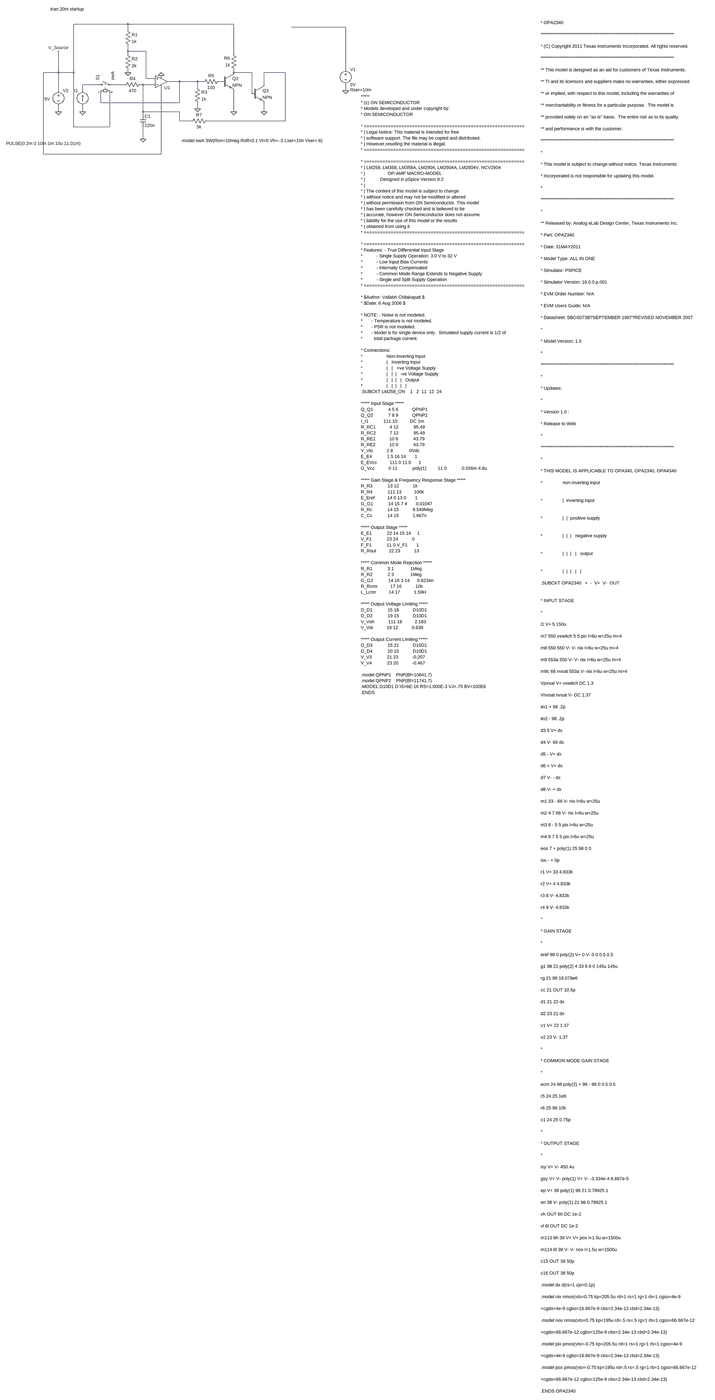
[diagram p0: schematic analog_OVC_switchoff.asc, whole sheet]
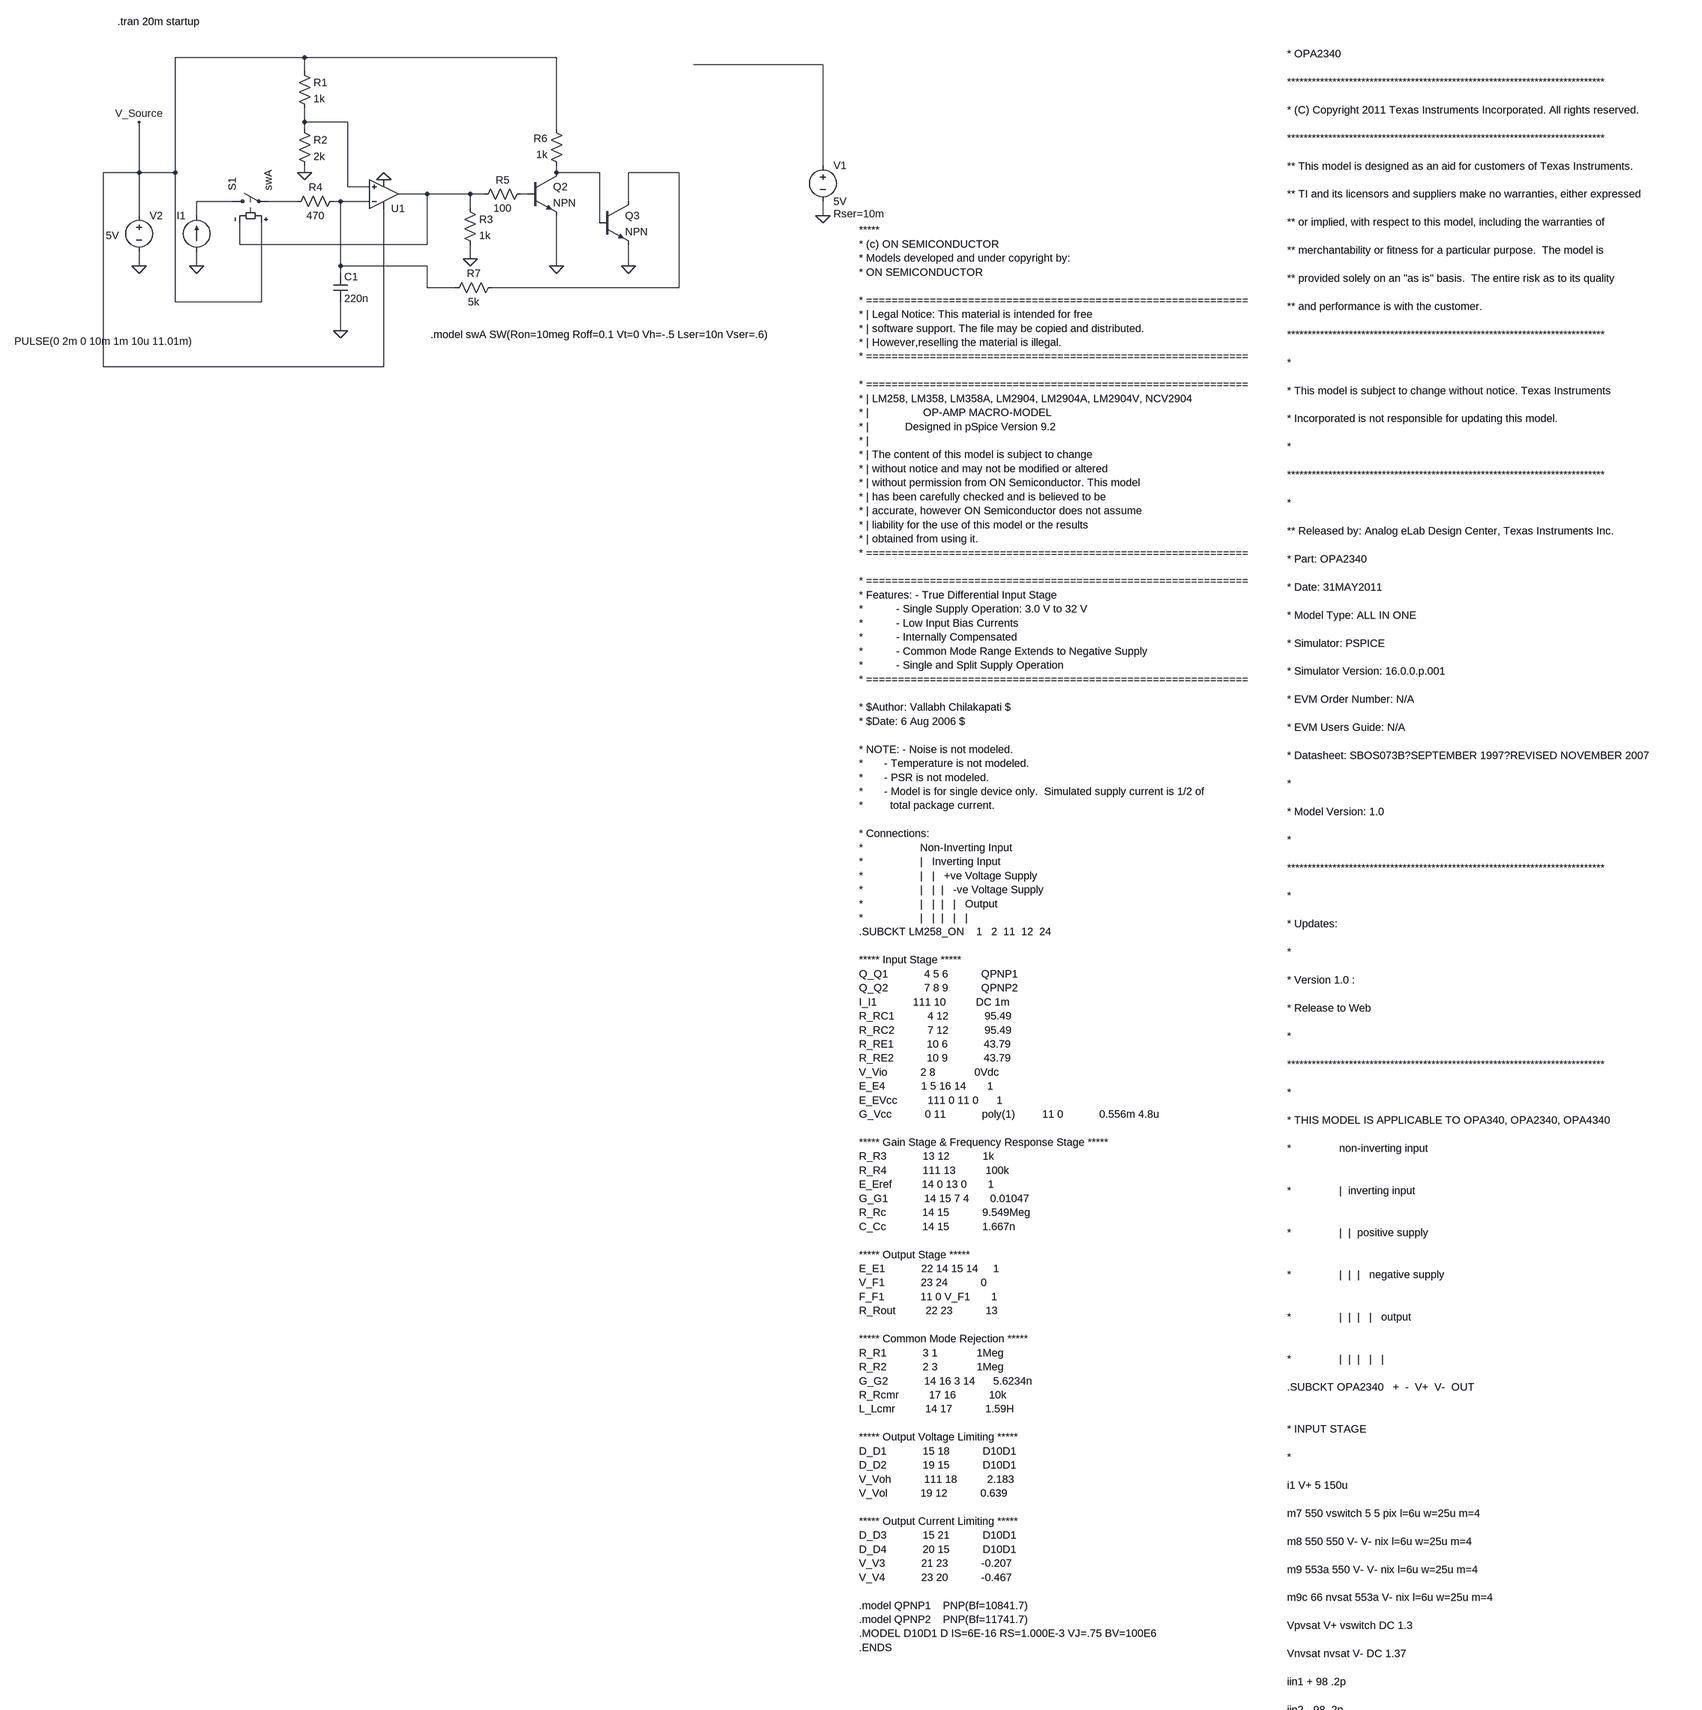
[diagram p1: schematic analog_OVC_switchoff.asc, part, row 1 of 2, column 1 of 1]
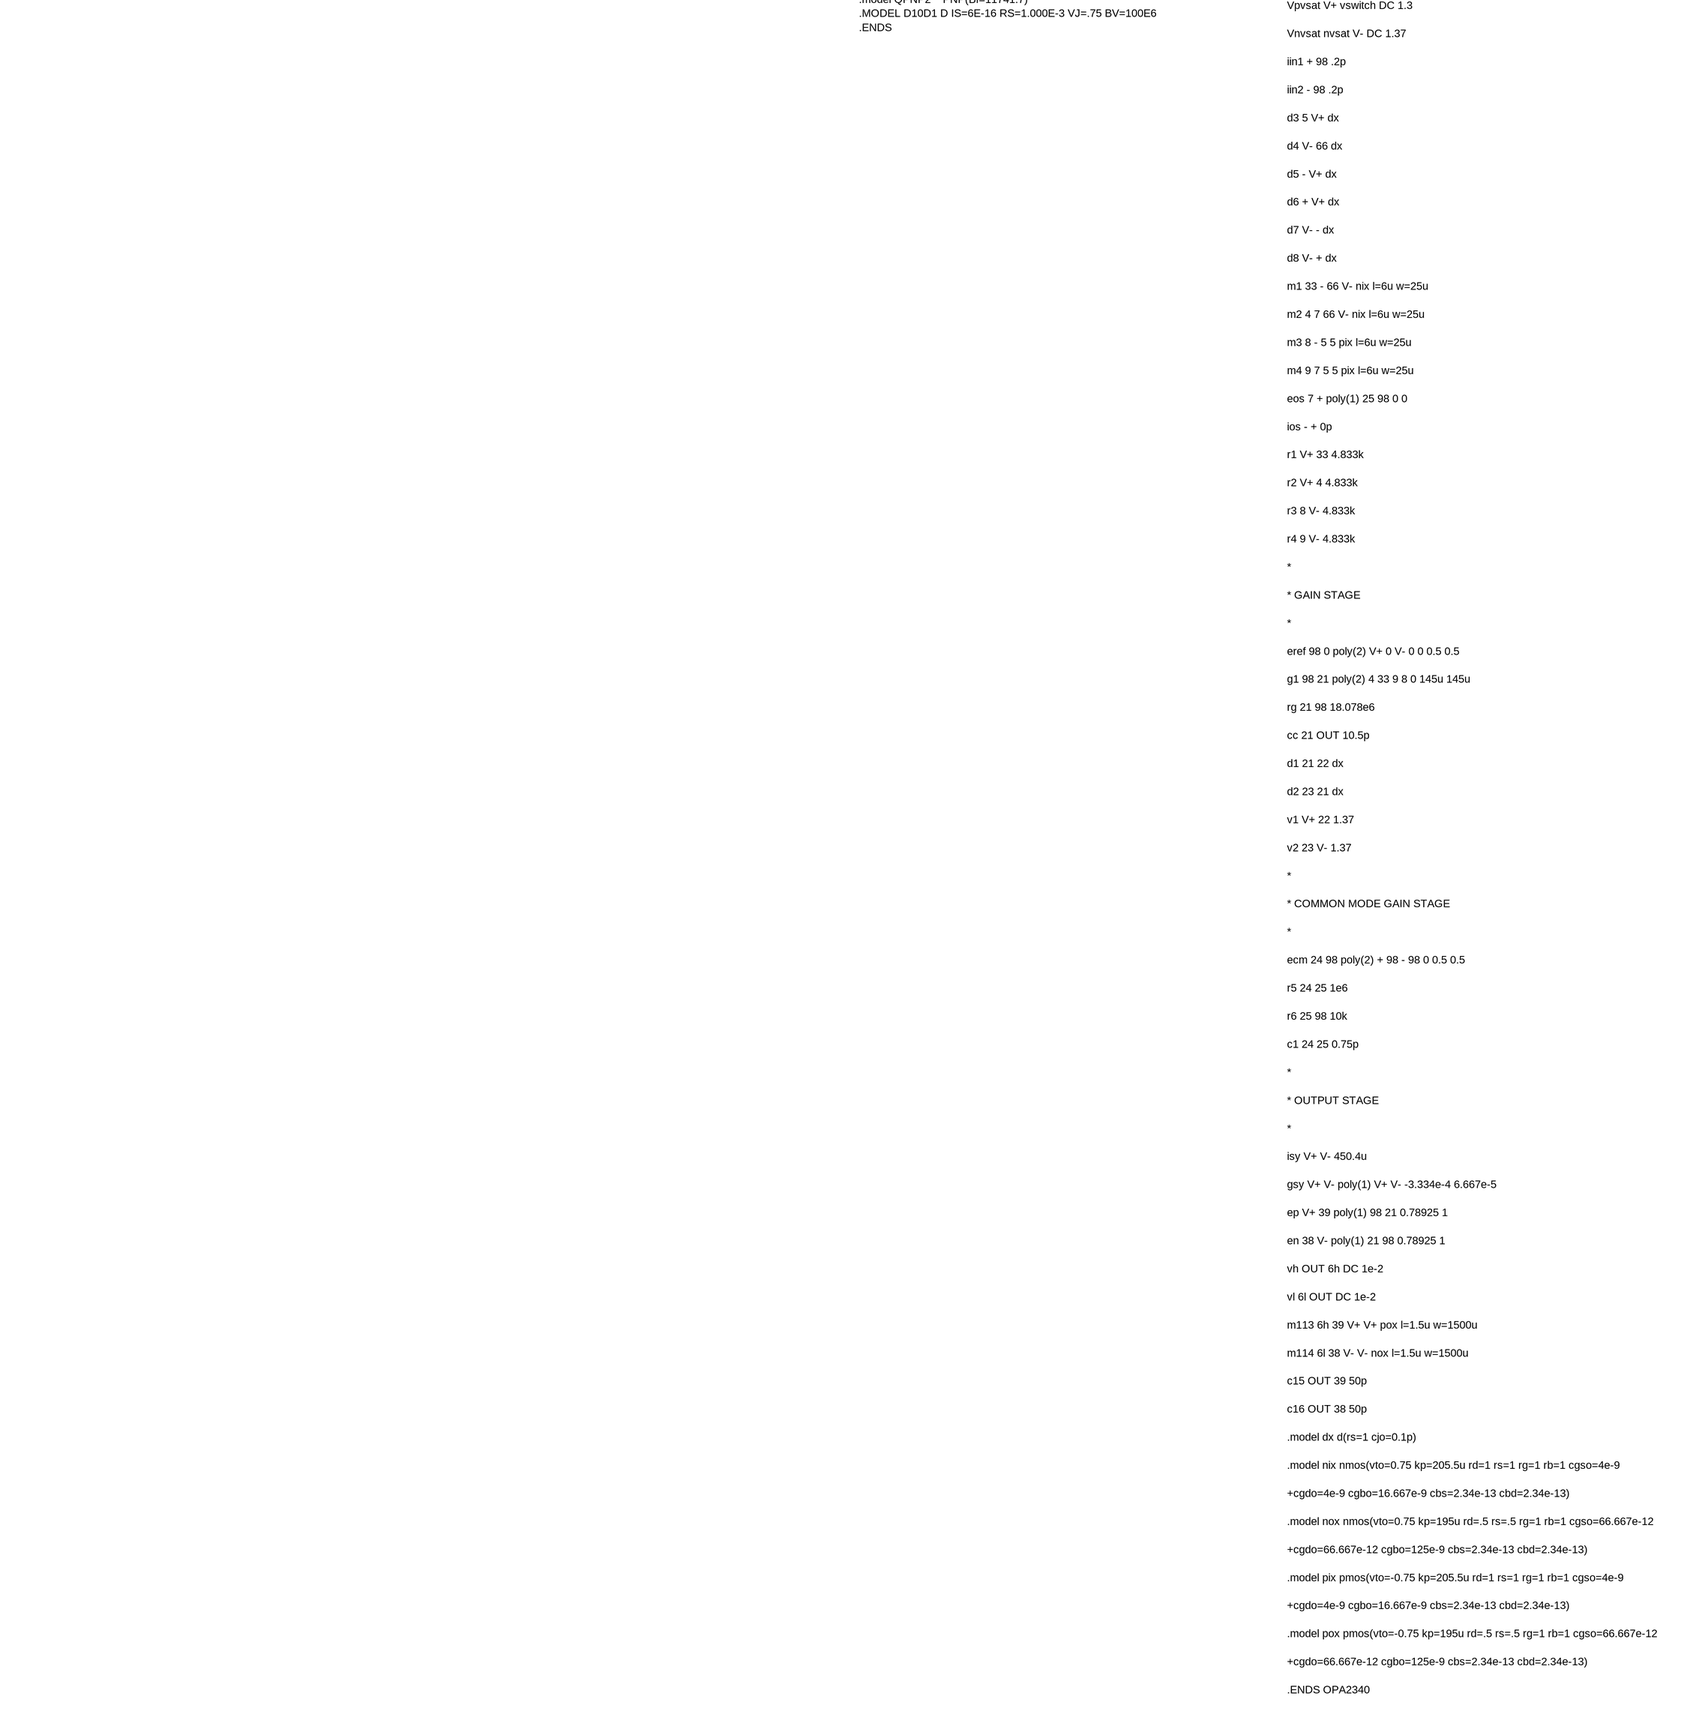
[diagram p2: schematic analog_OVC_switchoff.asc, part, row 2 of 2, column 1 of 1]
analog_OVC_switchoff.asc, the LTspice schematic file:
Version 4
SHEET 1 880 680
WIRE -6816 -5744 -7104 -5744
WIRE -6256 -5744 -6816 -5744
WIRE -5664 -5728 -5952 -5728
WIRE -6816 -5712 -6816 -5744
WIRE -6816 -5600 -6816 -5632
WIRE -6720 -5600 -6816 -5600
WIRE -6816 -5584 -6816 -5600
WIRE -6256 -5584 -6256 -5744
WIRE -5664 -5504 -5664 -5728
WIRE -7184 -5488 -7184 -5600
WIRE -7184 -5488 -7264 -5488
WIRE -7104 -5488 -7104 -5744
WIRE -7104 -5488 -7184 -5488
WIRE -6816 -5488 -6816 -5504
WIRE -6256 -5488 -6256 -5504
WIRE -6160 -5488 -6256 -5488
WIRE -5984 -5488 -6096 -5488
WIRE -6720 -5456 -6720 -5600
WIRE -6672 -5456 -6720 -5456
WIRE -6544 -5440 -6608 -5440
WIRE -6448 -5440 -6544 -5440
WIRE -6416 -5440 -6448 -5440
WIRE -6320 -5440 -6336 -5440
WIRE -6976 -5424 -7056 -5424
WIRE -6832 -5424 -6896 -5424
WIRE -6736 -5424 -6752 -5424
WIRE -6672 -5424 -6736 -5424
WIRE -6096 -5424 -6096 -5488
WIRE -6448 -5408 -6448 -5440
WIRE -7184 -5392 -7184 -5488
WIRE -7056 -5392 -7056 -5424
WIRE -5664 -5392 -5664 -5424
WIRE -6160 -5376 -6160 -5488
WIRE -6960 -5328 -6960 -5376
WIRE -6544 -5328 -6544 -5440
WIRE -6544 -5328 -6960 -5328
WIRE -6448 -5296 -6448 -5328
WIRE -7184 -5280 -7184 -5312
WIRE -7056 -5280 -7056 -5312
WIRE -6736 -5280 -6736 -5424
WIRE -6544 -5280 -6736 -5280
WIRE -6256 -5280 -6256 -5392
WIRE -6096 -5280 -6096 -5328
WIRE -6736 -5264 -6736 -5280
WIRE -6544 -5232 -6544 -5280
WIRE -6480 -5232 -6544 -5232
WIRE -5984 -5232 -5984 -5488
WIRE -5984 -5232 -6400 -5232
WIRE -7104 -5200 -7104 -5488
WIRE -6912 -5200 -6912 -5376
WIRE -6912 -5200 -7104 -5200
WIRE -6736 -5136 -6736 -5200
WIRE -7264 -5056 -7264 -5488
WIRE -6640 -5056 -6640 -5408
WIRE -6640 -5056 -7264 -5056
FLAG -7056 -5280 0
FLAG -5664 -5392 0
FLAG -6736 -5136 0
FLAG -7184 -5280 0
FLAG -7184 -5600 V_Source
FLAG -6640 -5472 0
FLAG -6816 -5488 0
FLAG -6448 -5296 0
FLAG -6096 -5280 0
FLAG -6256 -5280 0
SYMBOL voltage -5664 -5520 R0
WINDOW 123 0 0 Left 0
WINDOW 39 24 124 Left 0
SYMATTR SpiceLine Rser=10m
SYMATTR InstName V1
SYMATTR Value 5V
SYMBOL res -6848 -5408 R270
WINDOW 0 32 56 VTop 0
WINDOW 3 0 56 VBottom 0
SYMATTR InstName R4
SYMATTR Value 470
SYMBOL voltage -7184 -5408 R0
WINDOW 123 0 0 Left 0
WINDOW 39 0 0 Left 0
WINDOW 3 -74 60 Left 0
SYMATTR Value 5V
SYMATTR InstName V2
SYMBOL current -7056 -5312 R180
WINDOW 0 24 80 Left 0
WINDOW 3 7 -199 Left 0
WINDOW 123 0 0 Left 0
WINDOW 39 0 0 Left 0
SYMATTR InstName I1
SYMATTR Value PULSE(0 2m 0 10m 1m 10u 11.01m)
SYMBOL Opamps\\opamp2 -6640 -5376 M180
SYMATTR InstName U1
SYMATTR Value ""
SYMATTR SpiceModel OPA2340
SYMBOL res -6832 -5728 R0
SYMATTR InstName R1
SYMATTR Value 1k
SYMBOL res -6832 -5600 R0
SYMATTR InstName R2
SYMATTR Value 2k
SYMBOL res -6464 -5424 R0
SYMATTR InstName R3
SYMATTR Value 1k
SYMBOL cap -6752 -5264 R0
SYMATTR InstName C1
SYMATTR Value 220n
SYMBOL npn -6320 -5488 R0
SYMATTR InstName Q2
SYMBOL npn -6160 -5424 R0
SYMATTR InstName Q3
SYMBOL res -6320 -5456 R90
WINDOW 0 0 56 VBottom 0
WINDOW 3 32 56 VTop 0
SYMATTR InstName R5
SYMATTR Value 100
SYMBOL res -6240 -5488 R180
WINDOW 0 36 76 Left 0
WINDOW 3 36 40 Left 0
SYMATTR InstName R6
SYMATTR Value 1k
SYMBOL res -6384 -5248 R90
WINDOW 0 0 56 VBottom 0
WINDOW 3 32 56 VTop 0
SYMATTR InstName R7
SYMATTR Value 5k
SYMBOL sw -6992 -5424 R270
SYMATTR InstName S1
SYMATTR Value swA
TEXT -7232 -5824 Left 0 !.tran 20m startup
TEXT -5584 -5360 Left 0 !*****\n* (c) ON SEMICONDUCTOR\n* Models developed and under copyright by:\n* ON SEMICONDUCTOR \n \n* ============================================================\n* | Legal Notice: This material is intended for free  \n* | software support. The file may be copied and distributed. \n* | However,reselling the material is illegal.\n* ============================================================\n \n* ============================================================      \n* | LM258, LM358, LM358A, LM2904, LM2904A, LM2904V, NCV2904\n* |                  OP-AMP MACRO-MODEL\n* |            Designed in pSpice Version 9.2\n* |\n* | The content of this model is subject to change\n* | without notice and may not be modified or altered\n* | without permission from ON Semiconductor. This model\n* | has been carefully checked and is believed to be\n* | accurate, however ON Semiconductor does not assume \n* | liability for the use of this model or the results \n* | obtained from using it.\n* ============================================================\n \n* ============================================================\n* Features: - True Differential Input Stage\n*           - Single Supply Operation: 3.0 V to 32 V\n*           - Low Input Bias Currents\n*           - Internally Compensated\n*           - Common Mode Range Extends to Negative Supply\n*           - Single and Split Supply Operation\n* ============================================================\n \n* $Author: Vallabh Chilakapati $\n* $Date: 6 Aug 2006 $\n \n* NOTE: - Noise is not modeled.\n*       - Temperature is not modeled.\n*       - PSR is not modeled.\n*       - Model is for single device only.  Simulated supply current is 1/2 of\n*         total package current.\n \n* Connections:\n*                   Non-Inverting Input\n*                   |   Inverting Input\n*                   |   |   +ve Voltage Supply\n*                   |   |  |   -ve Voltage Supply\n*                   |   |  |   |   Output\n*                   |   |  |   |   |\n.SUBCKT LM258_ON    1   2  11  12  24\n \n***** Input Stage *****\nQ_Q1            4 5 6           QPNP1    \nQ_Q2            7 8 9           QPNP2\nI_I1            111 10          DC 1m\nR_RC1           4 12            95.49 \nR_RC2           7 12            95.49\nR_RE1           10 6            43.79 \nR_RE2           10 9            43.79\nV_Vio           2 8             0Vdc\nE_E4            1 5 16 14       1\nE_EVcc          111 0 11 0      1\nG_Vcc           0 11            poly(1)         11 0            0.556m 4.8u\n \n***** Gain Stage & Frequency Response Stage *****\nR_R3            13 12           1k  \nR_R4            111 13          100k  \nE_Eref          14 0 13 0       1\nG_G1            14 15 7 4       0.01047\nR_Rc            14 15           9.549Meg \nC_Cc            14 15           1.667n \n \n***** Output Stage *****\nE_E1            22 14 15 14     1\nV_F1            23 24           0\nF_F1            11 0 V_F1       1\nR_Rout          22 23           13\n \n***** Common Mode Rejection *****\nR_R1            3 1             1Meg\nR_R2            2 3             1Meg\nG_G2            14 16 3 14      5.6234n\nR_Rcmr          17 16           10k\nL_Lcmr          14 17           1.59H \n \n***** Output Voltage Limiting *****\nD_D1            15 18           D10D1\nD_D2            19 15           D10D1 \nV_Voh           111 18          2.183\nV_Vol           19 12           0.639\n \n***** Output Current Limiting *****\nD_D3            15 21           D10D1 \nD_D4            20 15           D10D1 \nV_V3            21 23           -0.207\nV_V4            23 20           -0.467\n \n.model QPNP1    PNP(Bf=10841.7)\n.model QPNP2    PNP(Bf=11741.7)\n.MODEL D10D1 D IS=6E-16 RS=1.000E-3 VJ=.75 BV=100E6\n.ENDS
TEXT -4632 -5752 Left 0 !* OPA2340\n\n*****************************************************************************\n\n* (C) Copyright 2011 Texas Instruments Incorporated. All rights reserved.                                            \n\n*****************************************************************************\n\n** This model is designed as an aid for customers of Texas Instruments.\n\n** TI and its licensors and suppliers make no warranties, either expressed\n\n** or implied, with respect to this model, including the warranties of \n\n** merchantability or fitness for a particular purpose.  The model is\n\n** provided solely on an "as is" basis.  The entire risk as to its quality\n\n** and performance is with the customer.\n\n*****************************************************************************\n\n*\n\n* This model is subject to change without notice. Texas Instruments\n\n* Incorporated is not responsible for updating this model.\n\n*\n\n*****************************************************************************\n\n*\n\n** Released by: Analog eLab Design Center, Texas Instruments Inc.\n\n* Part: OPA2340\n\n* Date: 31MAY2011\n\n* Model Type: ALL IN ONE\n\n* Simulator: PSPICE\n\n* Simulator Version: 16.0.0.p.001\n\n* EVM Order Number: N/A\n\n* EVM Users Guide: N/A\n\n* Datasheet: SBOS073B?SEPTEMBER 1997?REVISED NOVEMBER 2007\n\n*\n\n* Model Version: 1.0\n\n*\n\n*****************************************************************************\n\n*\n\n* Updates:\n\n*\n\n* Version 1.0 : \n\n* Release to Web\n\n*\n\n*****************************************************************************\n\n*\n\n* THIS MODEL IS APPLICABLE TO OPA340, OPA2340, OPA4340\n\n*                non-inverting input\n\n\n*                |  inverting input\n\n\n*                |  |  positive supply\n\n\n*                |  |  |   negative supply\n\n\n*                |  |  |   |   output\n\n\n*                |  |  |   |   |\n\n.SUBCKT OPA2340   +  -  V+  V-  OUT\n\n\n* INPUT STAGE\n\n*\n\ni1 V+ 5 150u\n\nm7 550 vswitch 5 5 pix l=6u w=25u m=4\n\nm8 550 550 V- V- nix l=6u w=25u m=4\n\nm9 553a 550 V- V- nix l=6u w=25u m=4\n\nm9c 66 nvsat 553a V- nix l=6u w=25u m=4\n\nVpvsat V+ vswitch DC 1.3\n\nVnvsat nvsat V- DC 1.37\n\niin1 + 98 .2p\n\niin2 - 98 .2p\n\nd3 5 V+ dx\n\nd4 V- 66 dx\n\nd5 - V+ dx\n\nd6 + V+ dx\n\nd7 V- - dx\n\nd8 V- + dx\n\nm1 33 - 66 V- nix l=6u w=25u\n\nm2 4 7 66 V- nix l=6u w=25u\n\nm3 8 - 5 5 pix l=6u w=25u\n\nm4 9 7 5 5 pix l=6u w=25u\n\neos 7 + poly(1) 25 98 0 0\n\nios - + 0p\n\nr1 V+ 33 4.833k\n\nr2 V+ 4 4.833k\n\nr3 8 V- 4.833k\n\nr4 9 V- 4.833k\n\n*\n\n* GAIN STAGE\n\n*\n\neref 98 0 poly(2) V+ 0 V- 0 0 0.5 0.5\n\ng1 98 21 poly(2) 4 33 9 8 0 145u 145u\n\nrg 21 98 18.078e6\n\ncc 21 OUT 10.5p\n\nd1 21 22 dx\n\nd2 23 21 dx\n\nv1 V+ 22 1.37\n\nv2 23 V- 1.37\n\n*\n\n* COMMON MODE GAIN STAGE\n\n*\n\necm 24 98 poly(2) + 98 - 98 0 0.5 0.5\n\nr5 24 25 1e6\n\nr6 25 98 10k\n\nc1 24 25 0.75p\n\n*\n\n* OUTPUT STAGE\n\n*\n\nisy V+ V- 450.4u\n\ngsy V+ V- poly(1) V+ V- -3.334e-4 6.667e-5\n\nep V+ 39 poly(1) 98 21 0.78925 1\n\nen 38 V- poly(1) 21 98 0.78925 1\n\nvh OUT 6h DC 1e-2\n\nvl 6l OUT DC 1e-2 \n\nm113 6h 39 V+ V+ pox l=1.5u w=1500u\n\nm114 6l 38 V- V- nox l=1.5u w=1500u\n\nc15 OUT 39 50p\n\nc16 OUT 38 50p\n\n.model dx d(rs=1 cjo=0.1p)\n\n.model nix nmos(vto=0.75 kp=205.5u rd=1 rs=1 rg=1 rb=1 cgso=4e-9\n\n+cgdo=4e-9 cgbo=16.667e-9 cbs=2.34e-13 cbd=2.34e-13)\n\n.model nox nmos(vto=0.75 kp=195u rd=.5 rs=.5 rg=1 rb=1 cgso=66.667e-12\n\n+cgdo=66.667e-12 cgbo=125e-9 cbs=2.34e-13 cbd=2.34e-13)\n\n.model pix pmos(vto=-0.75 kp=205.5u rd=1 rs=1 rg=1 rb=1 cgso=4e-9\n\n+cgdo=4e-9 cgbo=16.667e-9 cbs=2.34e-13 cbd=2.34e-13)\n\n.model pox pmos(vto=-0.75 kp=195u rd=.5 rs=.5 rg=1 rb=1 cgso=66.667e-12\n\n+cgdo=66.667e-12 cgbo=125e-9 cbs=2.34e-13 cbd=2.34e-13)\n\n.ENDS OPA2340
TEXT -6536 -5128 Left 0 !.model swA SW(Ron=10meg Roff=0.1 Vt=0 Vh=-.5 Lser=10n Vser=.6)

The netlist it stands for:
* analog_OVC_switchoff.asc
V1 N001 0 5V Rser=10m
R4 N008 N009 470
V2 V_Source 0 5V
I1 0 N007 PULSE(0 2m 0 10m 1m 10u 11.01m)
XU1 N002 N009 V_Source 0 N005 OPA2340  ; pins In+ In- V+ V- OUT
R1 V_Source N002 1k
R2 N002 0 2k
R3 N005 0 1k
C1 N009 0 220n
Q2 N003 N006 0 0 NPN
Q3 N004 N003 0 0 NPN
R5 N006 N005 100
R6 N003 V_Source 1k
R7 N004 N009 5k
S1 N007 N008 V_Source N005 swA
.model NPN NPN
.model PNP PNP
.lib standard.bjt
.tran 20m startup
*****
* (c) ON SEMICONDUCTOR
* Models developed and under copyright by:
* ON SEMICONDUCTOR
* ============================================================
* | Legal Notice: This material is intended for free
* | software support. The file may be copied and distributed.
* | However,reselling the material is illegal.
* ============================================================
* ============================================================
* | LM258, LM358, LM358A, LM2904, LM2904A, LM2904V, NCV2904
* |                  OP-AMP MACRO-MODEL
* |            Designed in pSpice Version 9.2
* |
* | The content of this model is subject to change
* | without notice and may not be modified or altered
* | without permission from ON Semiconductor. This model
* | has been carefully checked and is believed to be
* | accurate, however ON Semiconductor does not assume
* | liability for the use of this model or the results
* | obtained from using it.
* ============================================================
* ============================================================
* Features: - True Differential Input Stage
*           - Single Supply Operation: 3.0 V to 32 V
*           - Low Input Bias Currents
*           - Internally Compensated
*           - Common Mode Range Extends to Negative Supply
*           - Single and Split Supply Operation
* ============================================================
* $Author: Vallabh Chilakapati $
* $Date: 6 Aug 2006 $
* NOTE: - Noise is not modeled.
*       - Temperature is not modeled.
*       - PSR is not modeled.
*       - Model is for single device only.  Simulated supply current is 1/2 of
*         total package current.
* Connections:
*                   Non-Inverting Input
*                   |   Inverting Input
*                   |   |   +ve Voltage Supply
*                   |   |  |   -ve Voltage Supply
*                   |   |  |   |   Output
*                   |   |  |   |   |
.SUBCKT LM258_ON    1   2  11  12  24
***** Input Stage *****
Q_Q1            4 5 6           QPNP1
Q_Q2            7 8 9           QPNP2
I_I1            111 10          DC 1m
R_RC1           4 12            95.49
R_RC2           7 12            95.49
R_RE1           10 6            43.79
R_RE2           10 9            43.79
V_Vio           2 8             0Vdc
E_E4            1 5 16 14       1
E_EVcc          111 0 11 0      1
G_Vcc           0 11            poly(1)         11 0            0.556m 4.8u
***** Gain Stage & Frequency Response Stage *****
R_R3            13 12           1k
R_R4            111 13          100k
E_Eref          14 0 13 0       1
G_G1            14 15 7 4       0.01047
R_Rc            14 15           9.549Meg
C_Cc            14 15           1.667n
***** Output Stage *****
E_E1            22 14 15 14     1
V_F1            23 24           0
F_F1            11 0 V_F1       1
R_Rout          22 23           13
***** Common Mode Rejection *****
R_R1            3 1             1Meg
R_R2            2 3             1Meg
G_G2            14 16 3 14      5.6234n
R_Rcmr          17 16           10k
L_Lcmr          14 17           1.59H
***** Output Voltage Limiting *****
D_D1            15 18           D10D1
D_D2            19 15           D10D1
V_Voh           111 18          2.183
V_Vol           19 12           0.639
***** Output Current Limiting *****
D_D3            15 21           D10D1
D_D4            20 15           D10D1
V_V3            21 23           -0.207
V_V4            23 20           -0.467
.model QPNP1    PNP(Bf=10841.7)
.model QPNP2    PNP(Bf=11741.7)
.MODEL D10D1 D IS=6E-16 RS=1.000E-3 VJ=.75 BV=100E6
.ENDS
* OPA2340
*****************************************************************************
* (C) Copyright 2011 Texas Instruments Incorporated. All rights reserved.
*****************************************************************************
** This model is designed as an aid for customers of Texas Instruments.
** TI and its licensors and suppliers make no warranties, either expressed
** or implied, with respect to this model, including the warranties of
** merchantability or fitness for a particular purpose.  The model is
** provided solely on an "as is" basis.  The entire risk as to its quality
** and performance is with the customer.
*****************************************************************************
*
* This model is subject to change without notice. Texas Instruments
* Incorporated is not responsible for updating this model.
*
*****************************************************************************
*
** Released by: Analog eLab Design Center, Texas Instruments Inc.
* Part: OPA2340
* Date: 31MAY2011
* Model Type: ALL IN ONE
* Simulator: PSPICE
* Simulator Version: 16.0.0.p.001
* EVM Order Number: N/A
* EVM Users Guide: N/A
* Datasheet: SBOS073B?SEPTEMBER 1997?REVISED NOVEMBER 2007
*
* Model Version: 1.0
*
*****************************************************************************
*
* Updates:
*
* Version 1.0 :
* Release to Web
*
*****************************************************************************
*
* THIS MODEL IS APPLICABLE TO OPA340, OPA2340, OPA4340
*                non-inverting input
*                |  inverting input
*                |  |  positive supply
*                |  |  |   negative supply
*                |  |  |   |   output
*                |  |  |   |   |
.SUBCKT OPA2340   +  -  V+  V-  OUT
* INPUT STAGE
*
i1 V+ 5 150u
m7 550 vswitch 5 5 pix l=6u w=25u m=4
m8 550 550 V- V- nix l=6u w=25u m=4
m9 553a 550 V- V- nix l=6u w=25u m=4
m9c 66 nvsat 553a V- nix l=6u w=25u m=4
Vpvsat V+ vswitch DC 1.3
Vnvsat nvsat V- DC 1.37
iin1 + 98 .2p
iin2 - 98 .2p
d3 5 V+ dx
d4 V- 66 dx
d5 - V+ dx
d6 + V+ dx
d7 V- - dx
d8 V- + dx
m1 33 - 66 V- nix l=6u w=25u
m2 4 7 66 V- nix l=6u w=25u
m3 8 - 5 5 pix l=6u w=25u
m4 9 7 5 5 pix l=6u w=25u
eos 7 + poly(1) 25 98 0 0
ios - + 0p
r1 V+ 33 4.833k
r2 V+ 4 4.833k
r3 8 V- 4.833k
r4 9 V- 4.833k
*
* GAIN STAGE
*
eref 98 0 poly(2) V+ 0 V- 0 0 0.5 0.5
g1 98 21 poly(2) 4 33 9 8 0 145u 145u
rg 21 98 18.078e6
cc 21 OUT 10.5p
d1 21 22 dx
d2 23 21 dx
v1 V+ 22 1.37
v2 23 V- 1.37
*
* COMMON MODE GAIN STAGE
*
ecm 24 98 poly(2) + 98 - 98 0 0.5 0.5
r5 24 25 1e6
r6 25 98 10k
c1 24 25 0.75p
*
* OUTPUT STAGE
*
isy V+ V- 450.4u
gsy V+ V- poly(1) V+ V- -3.334e-4 6.667e-5
ep V+ 39 poly(1) 98 21 0.78925 1
en 38 V- poly(1) 21 98 0.78925 1
vh OUT 6h DC 1e-2
vl 6l OUT DC 1e-2
m113 6h 39 V+ V+ pox l=1.5u w=1500u
m114 6l 38 V- V- nox l=1.5u w=1500u
c15 OUT 39 50p
c16 OUT 38 50p
.model dx d(rs=1 cjo=0.1p)
.model nix nmos(vto=0.75 kp=205.5u rd=1 rs=1 rg=1 rb=1 cgso=4e-9
+cgdo=4e-9 cgbo=16.667e-9 cbs=2.34e-13 cbd=2.34e-13)
.model nox nmos(vto=0.75 kp=195u rd=.5 rs=.5 rg=1 rb=1 cgso=66.667e-12
+cgdo=66.667e-12 cgbo=125e-9 cbs=2.34e-13 cbd=2.34e-13)
.model pix pmos(vto=-0.75 kp=205.5u rd=1 rs=1 rg=1 rb=1 cgso=4e-9
+cgdo=4e-9 cgbo=16.667e-9 cbs=2.34e-13 cbd=2.34e-13)
.model pox pmos(vto=-0.75 kp=195u rd=.5 rs=.5 rg=1 rb=1 cgso=66.667e-12
+cgdo=66.667e-12 cgbo=125e-9 cbs=2.34e-13 cbd=2.34e-13)
.ENDS OPA2340
.model swA SW(Ron=10meg Roff=0.1 Vt=0 Vh=-.5 Lser=10n Vser=.6)
.backanno
.end